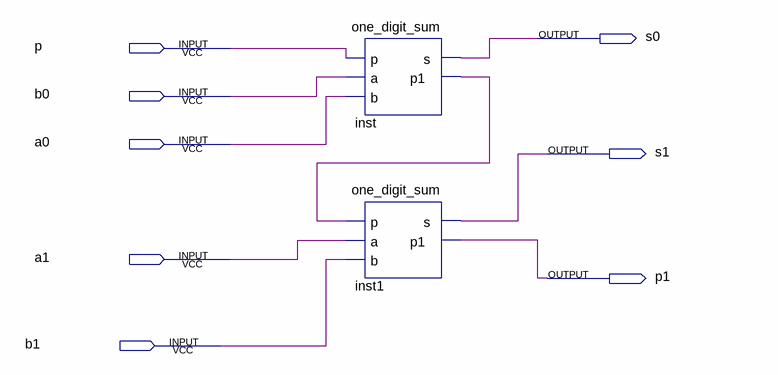
[diagram p0: schematic sheet]
// Quartus schematic two_digit_sum.bdf as structural Verilog: 2 symbols, 8 pins
module two_digit_sum (
  input  p,
  input  b0,
  input  a0,
  input  a1,
  input  b1,
  output s0,
  output s1,
  output p1
);

  wire inst_p1;

  one_digit_sum inst (.p(p), .a(b0), .b(a0), .s(s0), .p1(inst_p1));
  one_digit_sum inst1 (.p(inst_p1), .a(a1), .b(b1), .s(s1), .p1(p1));
endmodule
